# Altium project sar20-motor-driver.PrjPcb
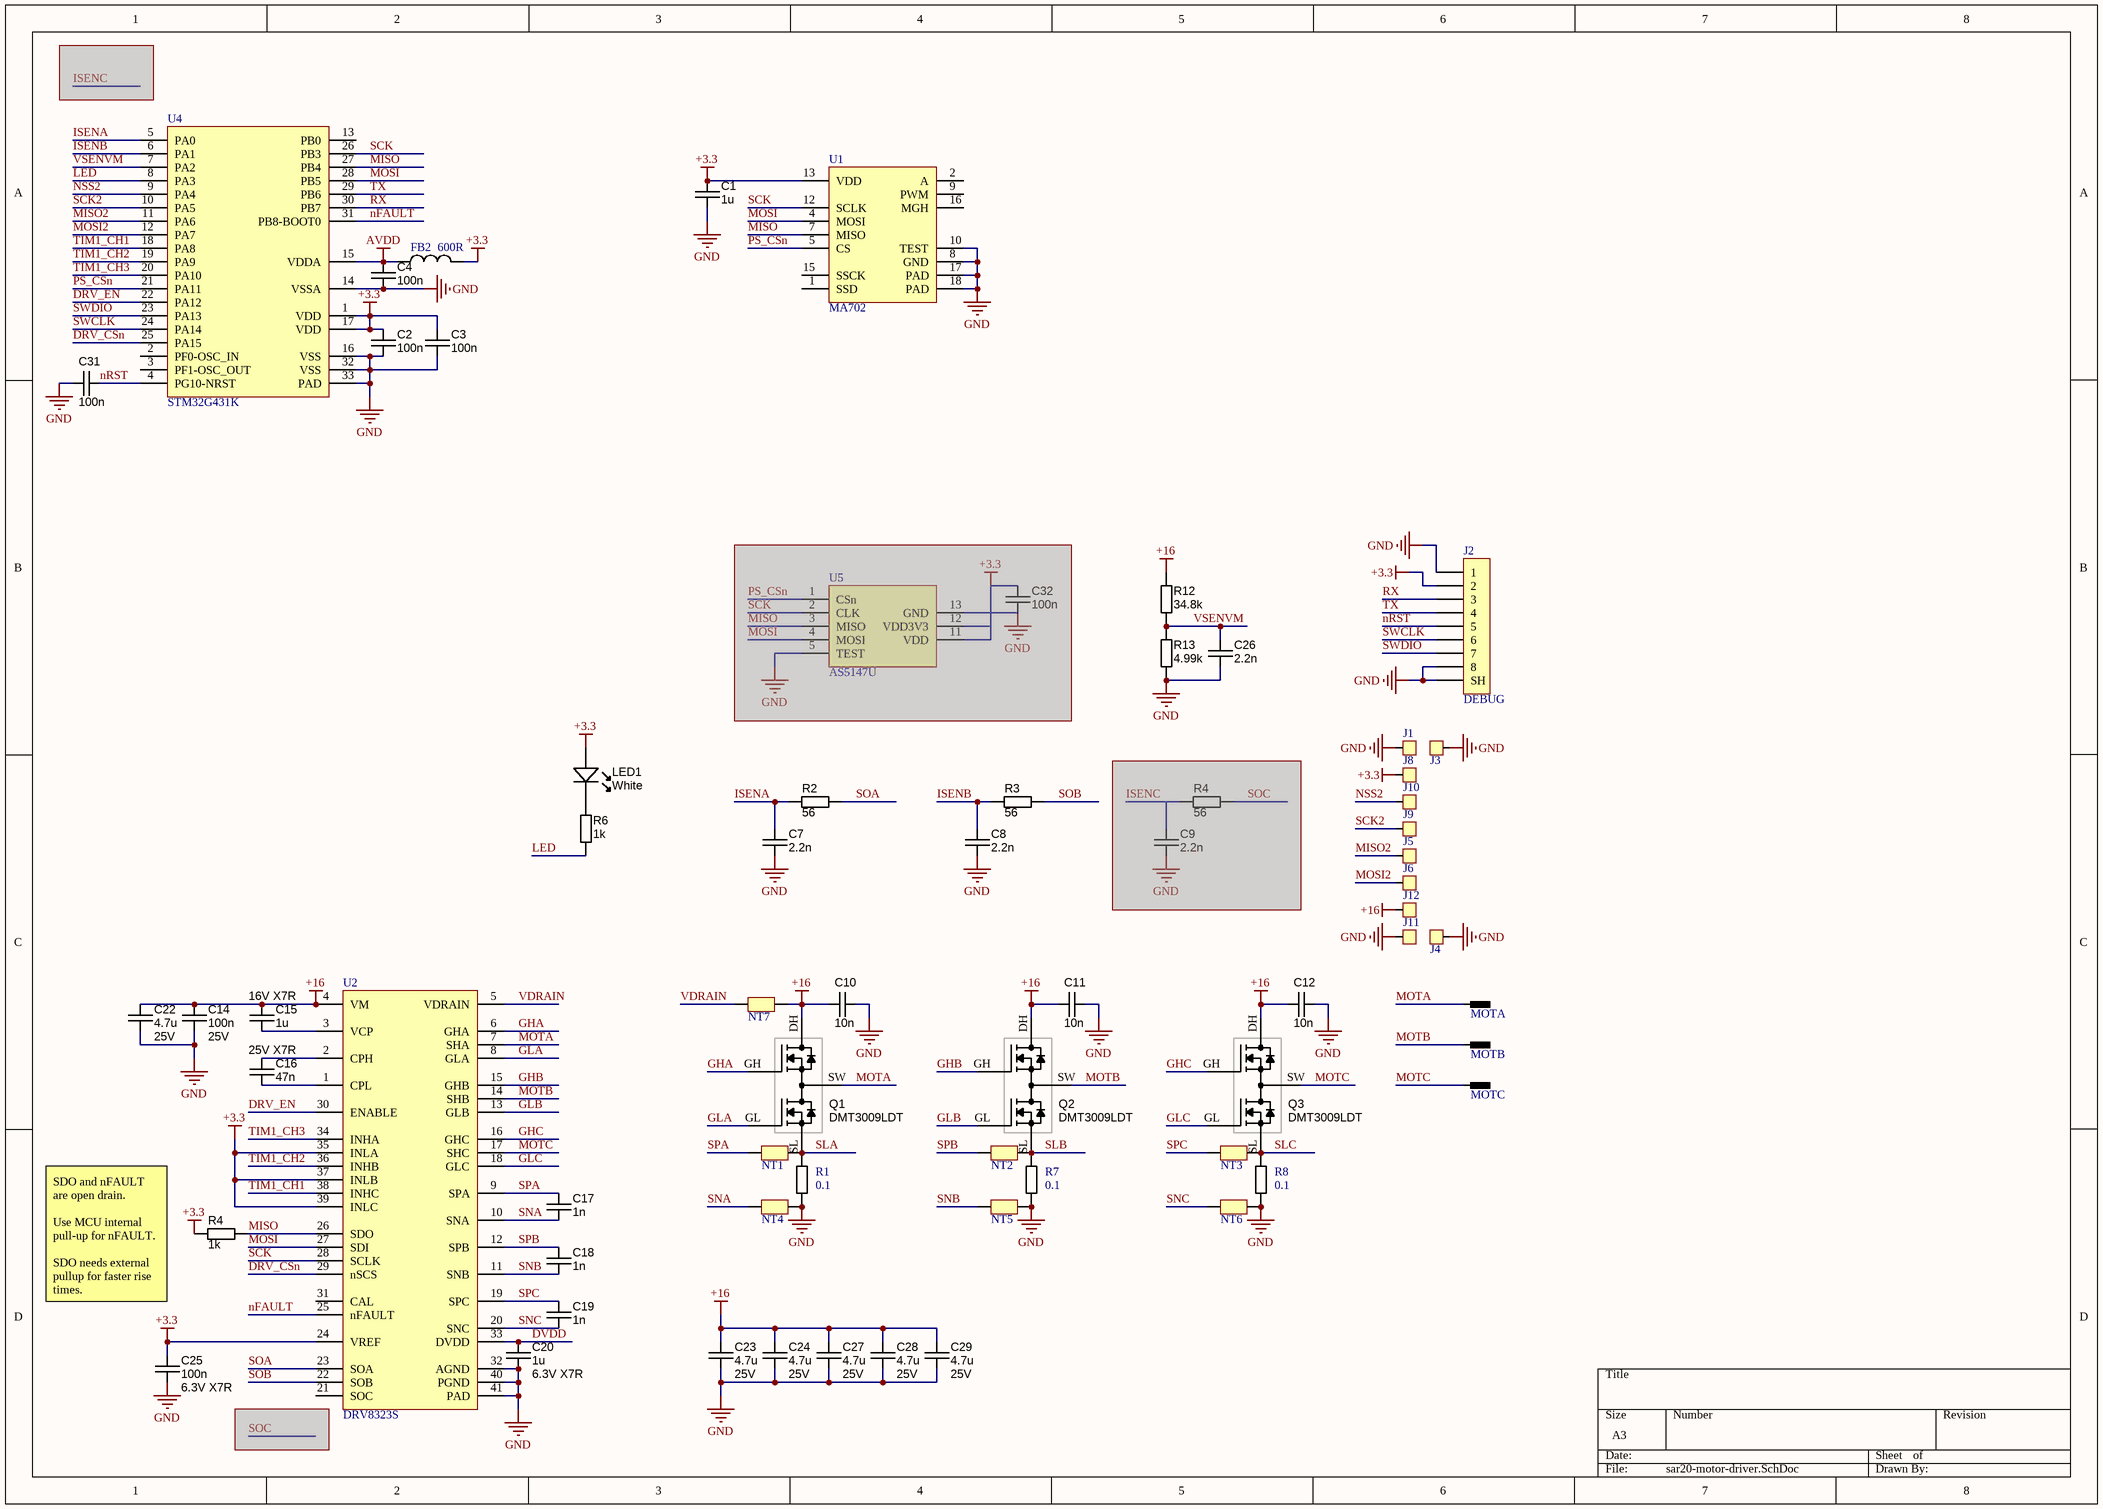
[diagram p0: sar20-motor-driver.SchDoc]
1 sheet, 67 parts. Net scope: global (net labels, ports and power ports of the same name join across sheets).
Board file: sar20-motor-driver.PcbDoc

## Sheet sar20-motor-driver.SchDoc
size A3

### Parts
(Parts that share a designator on the sheet are numbered #1, #2 ... from top to bottom, then left to right.)
C1  1u  [CAPC1608X90N]
C2  100n  [CAPC1005X55N]
C3  100n  [CAPC1005X55N]
C4  100n  [CAPC1005X55N]
C7  2.2n  [CAPC1005X55N]
C8  2.2n  [CAPC1005X55N]
C9  2.2n  [CAPC1005X55N]  (masked out: inside a compile mask, not in the netlist)
C10  10n  [CAPC1005X55N]
C11  10n  [CAPC1005X55N]
C12  10n  [CAPC1005X55N]
C14  Ratings: 25V  [CAPC1608X90N]  (hidden comment: 100n)
C15  Ratings: 16V X7R  [CAPC1608X90N]  (hidden comment: 1u)
C16  Ratings: 25V X7R  [CAPC1608X90N]  (hidden comment: 47n)
C17  1n  [CAPC1005X55N]
C18  1n  [CAPC1005X55N]
C19  1n  [CAPC1005X55N]
C20  Ratings: 6.3V X7R  [CAPC1608X90N]  (hidden comment: 1u)
C22  value 4.7u  Ratings: 25V  [CAPC2012X135N]
C23  value 4.7u  Ratings: 25V  [CAPC2012X135N]
C24  value 4.7u  Ratings: 25V  [CAPC2012X135N]
C25  Ratings: 6.3V X7R  [CAPC1005X55N]  (hidden comment: 100n)
C26  2.2n  [CAPC1005X55N]
C27  value 4.7u  Ratings: 25V  [CAPC2012X135N]
C28  value 4.7u  Ratings: 25V  [CAPC2012X135N]
C29  value 4.7u  Ratings: 25V  [CAPC2012X135N]
C31  100n  [CAPC1005X55N]
C32  100n  [CAPC1005X55N]  (masked out: inside a compile mask, not in the netlist)
FB2  600R  [RESC1005X40N]
J1  SOLDER-PAD  [PAD-2020]  (value not drawn)
J2  DEBUG  [HIROSE-FH19C-8S-0.5SH]
J3  SOLDER-PAD  [PAD-2020]  (value not drawn)
J4  SOLDER-PAD  [PAD-2020]  (value not drawn)
J5  SOLDER-PAD  [PAD-1020]  (value not drawn)
J6  SOLDER-PAD  [PAD-1020]  (value not drawn)
J8  SOLDER-PAD  [PAD-1020]  (value not drawn)
J9  SOLDER-PAD  [PAD-1020]  (value not drawn)
J10  SOLDER-PAD  [PAD-1020]  (value not drawn)
J11  SOLDER-PAD  [PAD-4020]  (value not drawn)
J12  SOLDER-PAD  [PAD-3020]  (value not drawn)
LED1  White  [LED-0603-WHITE]
MOTA  POGO-PIN  [MILL-MAX_0921-0-15-20-76-14-11-0]  (value not drawn)
MOTB  POGO-PIN  [MILL-MAX_0921-0-15-20-76-14-11-0]  (value not drawn)
MOTC  POGO-PIN  [MILL-MAX_0921-0-15-20-76-14-11-0]  (value not drawn)
NT1  NET-TIE  [NET-TIE-0206]  (value not drawn)  (net tie, no BOM)
NT2  NET-TIE  [NET-TIE-0206]  (value not drawn)  (net tie, no BOM)
NT3  NET-TIE  [NET-TIE-0206]  (value not drawn)  (net tie, no BOM)
NT4  NET-TIE  [NET-TIE-0206]  (value not drawn)  (net tie, no BOM)
NT5  NET-TIE  [NET-TIE-0206]  (value not drawn)  (net tie, no BOM)
NT6  NET-TIE  [NET-TIE-0206]  (value not drawn)  (net tie, no BOM)
NT7  NET-TIE  [NET-TIE-0206]  (value not drawn)  (net tie, no BOM)
Q1  DMT3009LDT  [V-DFN3030-8 (Type K)]
Q2  DMT3009LDT  [V-DFN3030-8 (Type K)]
Q3  DMT3009LDT  [V-DFN3030-8 (Type K)]
R1  0.1  [RESC1608X55N_CURRENT_SENSE]  (net tie)
R2  value 56  [RESC1005X40N]  (hidden comment: Thick Film)
R3  value 56  [RESC1005X40N]  (hidden comment: Thick Film)
R4#1  value 56  [RESC1005X40N]  (hidden comment: Thick Film)  (masked out: inside a compile mask, not in the netlist)
R4#2  value 1k  [RESC1005X40N]  (hidden comment: Thick Film)
R6  value 1k  [RESC1005X40N]  (hidden comment: Thick Film)
R7  0.1  [RESC1608X55N_CURRENT_SENSE]  (net tie)
R8  0.1  [RESC1608X55N_CURRENT_SENSE]  (net tie)
R12  value 34.8k  [RESC1005X40N]  (hidden comment: Thick Film)
R13  value 4.99k  [RESC1005X40N]  (hidden comment: Thick Film)
U1  MA702  [MA702_MINIMAL_QFN16]
U2  DRV8323S  [WQFN_TI_RTA0040B]
U4  STM32G431K  [UFQFPN32]
U5  AS5147U  [TSSOP14_AS5147U_MINIMAL]  (masked out: inside a compile mask, not in the netlist)

### Nets
+3.3: C1.1 C2.1 C3.1 C25.1 FB2.2 J2.2 J8.1 LED1.A R4#2.1 U1.13(VDD) U2.24(VREF) U2.35(INLA) U2.37(INLB) U2.39(INLC) U4.1(VDD) U4.17(VDD)
+16: C10.2 C11.2 C12.2 C14.1 C15.1 C22.1 C23.1 C24.1 C27.1 C28.1 C29.1 J12.1 NT7.1 Q1.DH Q2.DH Q3.DH R12.1 U2.4(VM)
AVDD: C4.1 FB2.1 U4.15(VDDA)
GND: C1.2 C2.2 C3.2 C4.2 C7.2 C8.2 C10.1 C11.1 C12.1 C14.2 C20.2 C22.2 C23.2 C24.2 C25.2 C26.2 C27.2 C28.2 C29.2 C31.2 J1.1 J2.1 J2.8 J2.SH J3.1 J4.1 J11.1 NT4.1 NT5.1 NT6.1 R1.2 R7.2 R8.2 R13.2 U1.8(GND) U1.10(TEST) U1.17(PAD) U1.18(PAD) U2.32(AGND) U2.40(PGND) U2.41(PAD) U4.14(VSSA) U4.16(VSS) U4.32(VSS) U4.33(PAD)
DRV_CSn: U2.29(nSCS) U4.25(PA15)
DRV_EN: U2.30(ENABLE) U4.22(PA12)
DVDD: C20.1 U2.33(DVDD)
GHA: Q1.GH U2.6(GHA)
GHB: Q2.GH U2.15(GHB)
GHC: Q3.GH U2.16(GHC)
GLA: Q1.GL U2.8(GLA)
GLB: Q2.GL U2.13(GLB)
GLC: Q3.GL U2.18(GLC)
ISENA: C7.1 R2.1 U4.5(PA0)
ISENB: C8.1 R3.1 U4.6(PA1)
LED: R6.2 U4.8(PA3)
MISO: R4#2.2 U1.7(MISO) U2.26(SDO) U4.27(PB4)
MISO2: J5.1 U4.11(PA6)
MOSI: U1.4(MOSI) U2.27(SDI) U4.28(PB5)
MOSI2: J6.1 U4.12(PA7)
MOTA: MOTA.1 Q1.SW U2.7(SHA)
MOTB: MOTB.1 Q2.SW U2.14(SHB)
MOTC: MOTC.1 Q3.SW U2.17(SHC)
nFAULT: U2.25(nFAULT) U4.31(PB8-BOOT0)
nRST: C31.1 J2.5 U4.4(PG10-NRST)
NSS2: J10.1 U4.9(PA4)
PS_CSn: U1.5(CS) U4.21(PA11)
RX: J2.3 U4.30(PB7)
SCK: U1.12(SCLK) U2.28(SCLK) U4.26(PB3)
SCK2: J9.1 U4.10(PA5)
SLA: NT1.1 Q1.SL R1.1
SLB: NT2.1 Q2.SL R7.1
SLC: NT3.1 Q3.SL R8.1
SNA: C17.2 NT4.2 U2.10(SNA)
SNB: C18.2 NT5.2 U2.11(SNB)
SNC: C19.2 NT6.2 U2.20(SNC)
SOA: R2.2 U2.23(SOA)
SOB: R3.2 U2.22(SOB)
SPA: C17.1 NT1.2 U2.9(SPA)
SPB: C18.1 NT2.2 U2.12(SPB)
SPC: C19.1 NT3.2 U2.19(SPC)
SWCLK: J2.6 U4.24(PA14)
SWDIO: J2.7 U4.23(PA13)
TIM1_CH1: U2.38(INHC) U4.18(PA8)
TIM1_CH2: U2.36(INHB) U4.19(PA9)
TIM1_CH3: U2.34(INHA) U4.20(PA10)
TX: J2.4 U4.29(PB6)
VDRAIN: NT7.2 U2.5(VDRAIN)
VSENVM: C26.1 R12.2 R13.1 U4.7(PA2)
NetC15_2: C15.2 U2.3(VCP)
NetC16_1: C16.1 U2.2(CPH)
NetC16_2: C16.2 U2.1(CPL)
NetLED1_K: LED1.K R6.1

Not connected (* = marked no-connect by the designer): U1 1(SSD) 2(A) 9(PWM) 15(SSCK) 16(MGH); U2 21(SOC) 31(CAL); U4 2(PF0-OSC_IN) 3(PF1-OSC_OUT) 13(PB0)

### Notes on the sheet
- SDO and nFAULT are open drain.
  Use MCU internal pull-up for nFAULT.
  SDO needs external pullup for faster rise times.

### Library data of the parts
C1-C4 C7-C12 C17-C19 C26 C31 C32 = CAPC: Capacitor SMD Cer 1nF 10% 16V X7R 0402; Manufacturer 1: AVX Corporation; Manufacturer Part Number 1: 0402YC102KAT2A; Ratings: 16V; X7R; SCDType: spec; Tolerance: ±10%; Operating Temperature: -55°C ~ 125°C; Package / Case: 0402 (1005 Metric); Size / Dimension: 0.039" L x 0.020" W (1.00mm x 0.50mm); Manufacturer 2: Yageo; Manufacturer Part Number 2: CC0402KRX7R7BB102; Supplier 1: Digi-Key; Supplier Part Number 1: 478-6197-1-ND; ComponentLink1URL: http://www.avx.com/docs/Catalogs/cx7r.pdf; ComponentLink1Description: http://www.avx.com/docs/Catalogs/cx7r.pdf; Supplier 2: Digi-Key; Supplier Part Number 2: 311-1352-1-ND; ComponentLink2URL: http://www.yageo.com/documents/recent/UPY-GPHC_X7R_6.3V-to-50V_8.pdf; ComponentLink2Description: http://www.yageo.com/documents/recent/UPY-GPHC_X7R_6.3V-to-50V_8.pdf
  C1: Value: 1u
  C2-C4 C31 C32: Value: 100n
  C7-C9 C26: Value: 2.2n
  C10-C12: Value: 10n
  C17-C19: Value: 1n
C14-C16 C20 C25 = CAPC: Capacitor SMD Cer 1nF 10% 16V X7R 0402; Manufacturer 1: AVX Corporation; Manufacturer Part Number 1: 0402YC102KAT2A; SCDType: spec; Tolerance: ±10%; Operating Temperature: -55°C ~ 125°C; Package / Case: 0402 (1005 Metric); Size / Dimension: 0.039" L x 0.020" W (1.00mm x 0.50mm); Manufacturer 2: Yageo; Manufacturer Part Number 2: CC0402KRX7R7BB102; Supplier 1: Digi-Key; Supplier Part Number 1: 478-6197-1-ND; ComponentLink1URL: http://www.avx.com/docs/Catalogs/cx7r.pdf; ComponentLink1Description: http://www.avx.com/docs/Catalogs/cx7r.pdf; Supplier 2: Digi-Key; Supplier Part Number 2: 311-1352-1-ND; ComponentLink2URL: http://www.yageo.com/documents/recent/UPY-GPHC_X7R_6.3V-to-50V_8.pdf; ComponentLink2Description: http://www.yageo.com/documents/recent/UPY-GPHC_X7R_6.3V-to-50V_8.pdf
  C14 C25: Value: 100n
  C15 C20: Value: 1u
  C16: Value: 47n
C22-C24 C27-C29 = CAPC_4u7_0805: Capacitor SMD Cer 4.7uF 10% 16V X5R 0805; Manufacturer 1: Taiyo Yuden; Manufacturer Part Number 1: EMK212BJ475KG-T; Material: ceramic; SCDType: spec; Package / Case: 0805 (2012 Metric); Tolerance: ±10%; Supplier 1: Digi-Key; Supplier Part Number 1: 587-1294-1-ND; Operating Temperature: -55°C ~ 85°C; Size / Dimension: 0.079" L x 0.049" W (2.00mm x 1.25mm); Thickness (Max): 0.053" (1.35mm); ComponentLink1URL: http://www.yuden.co.jp/productdata/catalog/en/mlcc01_e.pdf; ComponentLink1Description: http://www.yuden.co.jp/productdata/catalog/en/mlcc01_e.pdf; Supplier 2: Digi-Key; Supplier Part Number 2: 1276-1065-1-ND; Manufacturer 2: Samsung Electro-Mechanics America, Inc; Manufacturer Part Number 2: CL21A475KOFNNNE; RoHS 2: RoHS Compliant; ComponentLink2URL: http://www.samsungsem.com/servlet/FileDownload?type=spec&file=CL21A475KOFNNNE.pdf; ComponentLink2Description: http://www.samsungsem.com/servlet/FileDownload?type=spec&file=CL21A475KOFNNNE.pdf; Supplier 3: Digi-Key; Supplier Part Number 3: 399-8101-1-ND; Manufacturer 3: Kemet; Manufacturer Part Number 3: C0805C475K4PACTU; RoHS 3: RoHS Compliant; ComponentLink3URL: http://capacitoredge.kemet.com/capedge2/DataSheet?pn=C0805C475K4PACTU; ComponentLink3Description: http://capacitoredge.kemet.com/capedge2/DataSheet?pn=C0805C475K4PACTU; Supplier 4: Digi-Key; Supplier Part Number 4: 490-7215-1-ND; Manufacturer 4: Murata Electronics North America; Manufacturer Part Number 4: GRM21BR61C475MA88L; RoHS 4: RoHS Compliant; ComponentLink4URL: http://psearch.murata.com/capacitor/product/GRM21BR61C475MA88#.pdf; ComponentLink4Description: http://psearch.murata.com/capacitor/product/GRM21BR61C475MA88#.pdf; Supplier 5: Digi-Key; Supplier Part Number 5: 445-7640-1-ND; Manufacturer 5: TDK Corporation; Manufacturer Part Number 5: C2012X5R1C475K125AC; RoHS 5: RoHS Compliant; ComponentLink5URL: http://product.tdk.com/capacitor/mlcc/en/documents/mlcc_commercial_general_en.pdf; ComponentLink5Description: http://product.tdk.com/capacitor/mlcc/en/documents/mlcc_commercial_general_en.pdf; RoHS 1: RoHS Compliant
FB2 = FERRITE_BEAD: Value: 600R
J2 = FPC-CONNECTOR
LED1 = LED_SMD_White_0603_Bright: LED 0603 SMD Bright White 8700K; Manufacturer 1: Lite-On Inc; Manufacturer Part Number 1: LTW-C193TS5; Material: InGaN; Ratings: Ultra Bright; 8700K; Millicandela Rating: 230mcd; Voltage - Forward (Vf) Typ: 3.3V; Viewing Angle: 120°; Lens Type: Clear, Tinted; Lens Style/Size: Rectangle with Flat Top, 0.8mm x 1.1mm; Voltage - Forward (Vf) @ 10mA: 3.0V; SCDType: source; Package / Case: 0603 (1608 metric); Supplier 1: Digi-Key; Supplier Part Number 1: 160-1721-1-ND; Supplier 2: Digi-Key; Supplier Part Number 2: APT1608QWF/D-ND; Manufacturer 2: Kingbright Corp; Manufacturer Part Number 2: APT1608QWF/D; Color: White; Size / Dimension: 1.60mm L x 0.80mm W; Mounting Type: Surface Mount; Luminous Flux @ Current - Test: -; ComponentLink2URL: http://www.kingbrightusa.com/images/catalog/SPEC/APT1608QWF-D.pdf; ComponentLink2Description: http://www.kingbrightusa.com/images/catalog/SPEC/APT1608QWF-D.pdf; ComponentLink1URL: http://media.digikey.com/pdf/Data%20Sheets/Lite-On%20PDFs/LTW-C193TS5.pdf; ComponentLink1Description: http://media.digikey.com/pdf/Data%20Sheets/Lite-On%20PDFs/LTW-C193TS5.pdf
R1 R7 R8 = RESISTOR_CURRENT_SENSE: Value: 0.1
R2 R3 R4#1 R12 R13 = RES_68R_0402_5%: Resistor SMD chip 68 Ohm 0.063W 5% 0402; Manufacturer 1: Yageo; Manufacturer Part Number 1: RC0402JR-0768RL; Ratings: 1/16 W; SCDType: spec; Package / Case: 0402 (1005 Metric); Tolerance: ±5%; Supplier 1: Digi-Key; Supplier Part Number 1: 311-68JRCT-ND; RoHS 1: RoHS Compliant; ComponentLink1URL: http://www.yageo.com/documents/recent/PYu-RC0402_51_RoHS_L_6.pdf; ComponentLink1Description: http://www.yageo.com/documents/recent/PYu-RC0402_51_RoHS_L_6.pdf; Supplier 2: Digi-Key; Supplier Part Number 2: 1276-4348-1-ND; Manufacturer 2: Samsung Electro-Mechanics America, Inc; Manufacturer Part Number 2: RC1005J680CS; RoHS 2: RoHS Compliant; ComponentLink2URL: http://www.samsungsem.com/servlet/FileDownload?filename=productcatalog/pdf/Chip_Resistor.pdf; ComponentLink2Description: http://www.samsungsem.com/servlet/FileDownload?filename=productcatalog/pdf/Chip_Resistor.pdf; Supplier 3: Digi-Key; Supplier Part Number 3: RMCF0402JT68R0CT-ND; Manufacturer 3: Stackpole Electronics Inc; Manufacturer Part Number 3: RMCF0402JT68R0; RoHS 3: RoHS Compliant; ComponentLink3URL: http://www.seielect.com/Catalog/SEI-RMCF_RMCP.pdf; ComponentLink3Description: http://www.seielect.com/Catalog/SEI-RMCF_RMCP.pdf; Supplier 4: Digi-Key; Supplier Part Number 4: RHM68CECT-ND; Manufacturer 4: Rohm Semiconductor; Manufacturer Part Number 4: MCR01MRTJ680; RoHS 4: RoHS Compliant; ComponentLink4URL: http://rohmfs.rohm.com/en/products/databook/datasheet/passive/resistor/chip_resistor/mcr_g.pdf; ComponentLink4Description: http://rohmfs.rohm.com/en/products/databook/datasheet/passive/resistor/chip_resistor/mcr_g.pdf
R4#2 R6 = RES_1K_0402_5%: Resistor SMD chip 1k Ohm 0.063W 5% 0402; Manufacturer 1: Yageo; Manufacturer Part Number 1: RC0402JR-071KL; Ratings: 1/16 W; SCDType: spec; Package / Case: 0402 (1005 Metric); Tolerance: ±5%; Supplier 1: Digi-Key; Supplier Part Number 1: 311-1.0KJRCT-ND; RoHS 1: RoHS Compliant; ComponentLink1URL: http://www.yageo.com/documents/recent/PYu-RC0402_51_RoHS_L_6.pdf; ComponentLink1Description: http://www.yageo.com/documents/recent/PYu-RC0402_51_RoHS_L_6.pdf; Supplier 2: Digi-Key; Supplier Part Number 2: 541-1.0KJCT-ND; Manufacturer 2: Vishay Dale; Manufacturer Part Number 2: CRCW04021K00JNED; RoHS 2: RoHS Compliant; ComponentLink2URL: http://www.vishay.com/doc?20035; ComponentLink2Description: http://www.vishay.com/doc?20035; Supplier 3: Digi-Key; Supplier Part Number 3: 1276-4376-1-ND; Manufacturer 3: Samsung Electro-Mechanics America, Inc; Manufacturer Part Number 3: RC1005J102CS; RoHS 3: RoHS Compliant; ComponentLink3URL: http://www.samsungsem.com/servlet/FileDownload?filename=productcatalog/pdf/Chip_Resistor.pdf; ComponentLink3Description: http://www.samsungsem.com/servlet/FileDownload?filename=productcatalog/pdf/Chip_Resistor.pdf; Supplier 4: Digi-Key; Supplier Part Number 4: RHM1.0KCECT-ND; Manufacturer 4: Rohm Semiconductor; Manufacturer Part Number 4: MCR01MRTJ102; RoHS 4: RoHS Compliant; ComponentLink4URL: http://rohmfs.rohm.com/en/products/databook/datasheet/passive/resistor/chip_resistor/mcr_g.pdf; ComponentLink4Description: http://rohmfs.rohm.com/en/products/databook/datasheet/passive/resistor/chip_resistor/mcr_g.pdf; Supplier 5: Digi-Key; Supplier Part Number 5: P1.0KJCT-ND; Manufacturer 5: Panasonic Electronic Components; Manufacturer Part Number 5: ERJ-2GEJ102X; RoHS 5: RoHS Compliant; ComponentLink5URL: http://industrial.panasonic.com/www-cgi/jvcr13pz.cgi?E+PZ+3+AOA0001+ERJ2GEJ102X+7+WW; ComponentLink5Description: http://industrial.panasonic.com/www-cgi/jvcr13pz.cgi?E+PZ+3+AOA0001+ERJ2GEJ102X+7+WW
U1 = MA702_MINIMAL
U5 = AS5147U_MINIMAL